# Altium schematic sheet 03 BGT24LTR11.SchDoc: <Project Name>
size A3; ApprovedBy: <Appr.>; Author: <Author>; CompanyName: Infineon Technologies AG; Engineer: <Rel.>; Organization: Infineon Technologies AG; Address1: IFAG DES S PS; Address2: Am Campeon 1-12  -  85579 Neubiberg  -  Germany; Address3: 85579 Neubiberg; Address4: Germany; Revision: <Rev.>; SheetNumber: 3; Release: RC00; PageSetup: Record=PageOptions|CenterHorizontal=True|CenterVertical=True|PrintScale=1.01|XCorrection=1.00|YCorrection=1.00|PrintKind=0|BorderSize=5000000|LeftOffset=0|BottomOffset=0|Orientation=2|PaperLength=1000|PaperWidth=1000|Scale=100|PaperSource=7|PrintQuality=-4|MediaType=1|DitherType=10|PaperKind=A3|PrintScaleMode=1; Doc_ConfidentialStatus: <Doc_ConfidentialStatus>; Doc_Preliminary: <Doc_Preliminary>
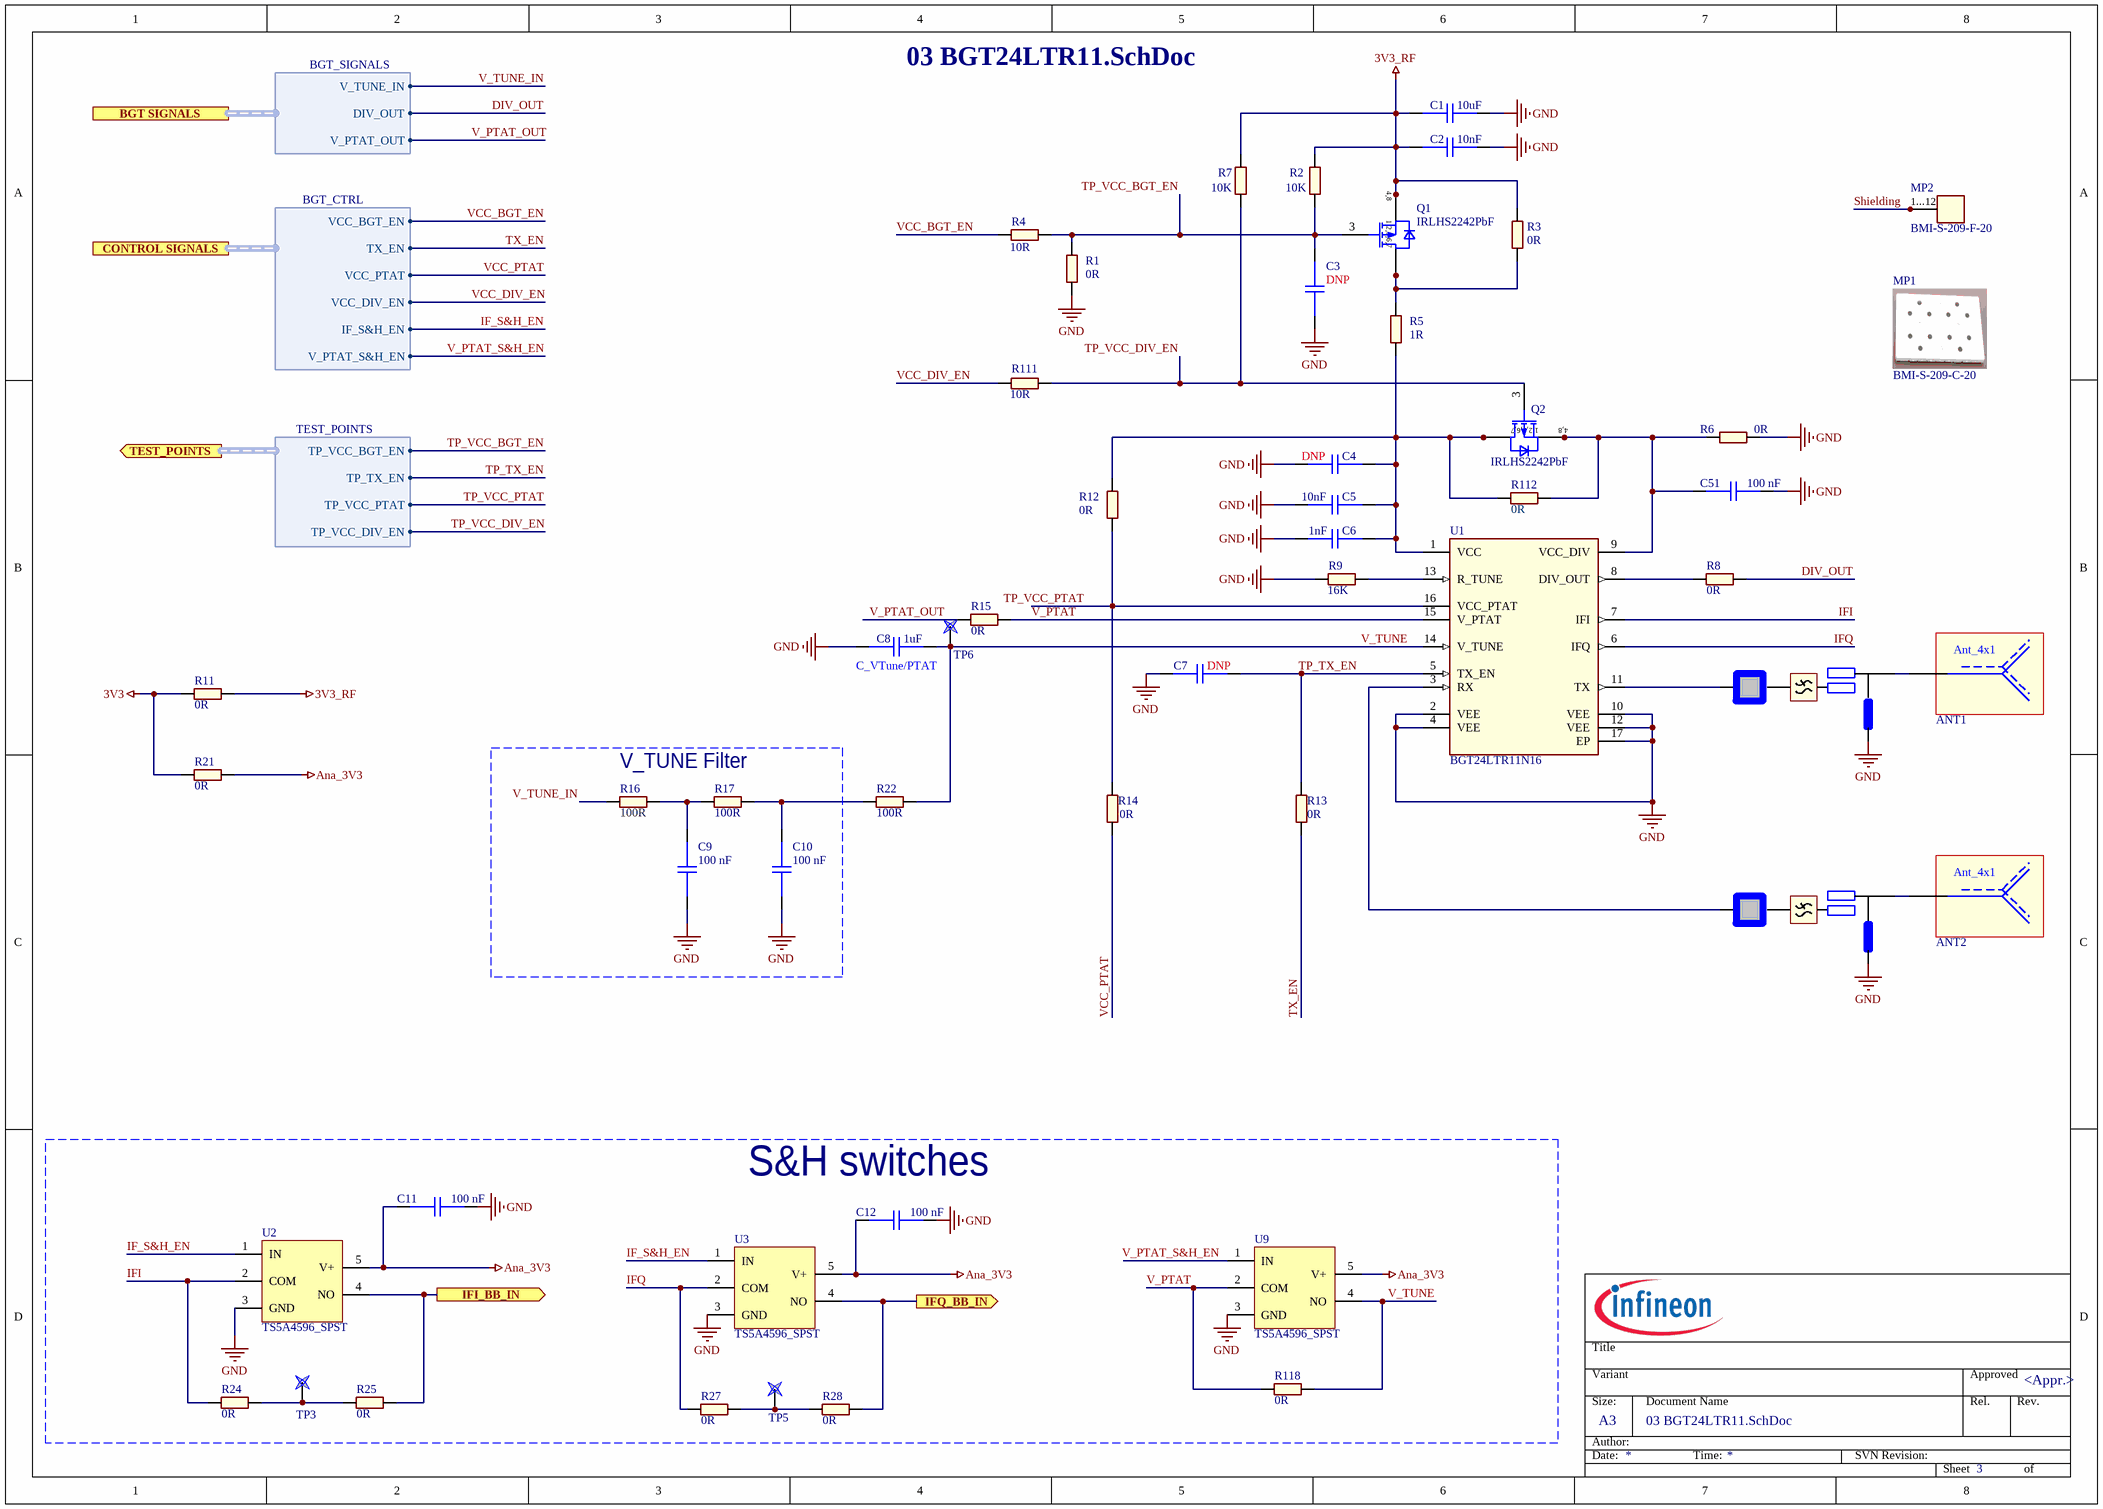
[diagram p0: 03 BGT24LTR11.SchDoc]

## Parts
ANT1  24GHZ S2G Antenna 4X1 Patch Array  [S2G_ANT]  (value not drawn)
ANT2  24GHZ S2G Antenna 4X1 Patch Array  [S2G_ANT]  (value not drawn)
C1  10uF  [CAPC1005X55N-0_2]
C2  10nF  [CAPC1005X55N-0_2]
C3  DNP  [CAPC1005X55N-0_2]
C4  DNP  [CAPC1005X55N-0_2]
C5  10nF  [CAPC1005X55N-0_2]
C6  1nF  [CAPC1005X55N-0_2]
C7  DNP  [CAPC1005X55N-0_2]
C8  1uF  [CAPC1005X55N-0_2]
C9  100 nF  [CAPC1005X55N-0_2]
C10  100 nF  [CAPC1005X55N-0_2]
C11  100 nF  [CAPC1005X55N-0_2]
C12  100 nF  [CAPC1005X55N-0_2]
C51  100 nF  [CAPC1005X55N-0_2]
M1  Maching 2nd Filter DCBlock  [MACHINING_LTR11]  (value not drawn)
M2  Maching 2nd Filter DCBlock  [OLD_MATCHING]  (value not drawn)
MP1  BMI-S-209-C-20  [SHIELD-BMI-S-209-C]
MP2  BMI-S-209-F-20  [SHIELD-SMD-BMI-S-209-F]
Q1  IRLHS2242PbF  [IRLHS2242-V]
Q2  IRLHS2242PbF  [IRLHS2242-V]
R1  0R  [RESC1005X40N_2]
R2  10K  [RESC1005X40N_2]
R3  0R  [RESC1005X40N_2]
R4  10R  [RESC1005X40N_2]
R5  1R  [RESC1005X40N_2]
R6  0R  [RESC1005X40N_2]
R7  10K  [RESC1005X40N_2]
R8  0R  [RESC1005X40N_2]
R9  16K  [RESC1005X40N_2]
R11  0R  [RESC1005X40N_2]
R12  0R  [RESC1005X40N_2]
R13  0R  [RESC1005X40N_2]
R14  0R  [RESC1005X40N_2]
R15  0R  [RESC1005X40N_2]
R16  100R  [RESC1005X40N_2]
R17  100R  [RESC1005X40N_2]
R21  0R  [RESC1005X40N_2]
R22  100R  [RESC1005X40N_2]
R24  0R  [RESC1005X40N_2]
R25  0R  [RESC1005X40N_2]
R27  0R  [RESC1005X40N_2]
R28  0R  [RESC1005X40N_2]
R111  10R  [RESC1005X40N_2]
R112  0R  [RESC1005X40N_2]
R118  0R  [RESC1005X40N_2]
TP3  Testpoint  [TP1.5MM]  (value not drawn)  (no BOM)
TP5  Testpoint  [TP1.5MM]  (value not drawn)  (no BOM)
TP6  Testpoint  [TP1.5MM]  (value not drawn)  (no BOM)
U1  BGT24LTR11N16  [PQFN50P240X240X77-17N-V]
U2  TS5A4596_SPST  [TS5A4597]
U3  TS5A4596_SPST  [TS5A4597]
U9  TS5A4596_SPST  [TS5A4597]

## Ports
BGT SIGNALS (harness BGT_SIGNALS), CONTROL SIGNALS (harness BGT_CTRL), IFI_BB_IN (out), IFQ_BB_IN (out), TEST_POINTS (out, harness TEST_POINTS)

## Harnesses
BGT_CTRL: VCC_BGT_EN, TX_EN, VCC_PTAT, VCC_DIV_EN, IF_S&H_EN, V_PTAT_S&H_EN
BGT_SIGNALS: V_TUNE_IN, DIV_OUT, V_PTAT_OUT
TEST_POINTS: TP_VCC_BGT_EN, TP_TX_EN, TP_VCC_PTAT, TP_VCC_DIV_EN

## Nets
3V3: R11.1 R21.2
3V3_RF: C1.1 C2.1 Q1.4(SOURCE1) Q1.8(SOURCE2) R2.2 R3.2 R7.2 R11.2
Ana_3V3: C11.2 C12.2 R21.1 U2.5(V+) U3.5(V+) U9.5(V+)
GND: C1.2 C2.2 C3.1 C4.1 C5.1 C6.1 C7.2 C8.2 C9.1 C10.1 C11.1 C12.1 C51.1 M1.3(GND) M2.3(GND) R1.1 R6.1 R9.1 U1.2(VEE) U1.4(VEE) U1.10(VEE) U1.12(VEE) U1.17(EP) U2.3(GND) U3.3(GND) U9.3(GND)
DIV_OUT: R8.1 ; port BGT SIGNALS.DIV_OUT
IF_S&H_EN: U2.1(IN) U3.1(IN) ; port CONTROL SIGNALS.IF_S&H_EN
IFI: R24.2 U1.7(IFI) U2.2(COM)
IFI_BB_IN: R25.1 U2.4(NO) ; port IFI_BB_IN
IFQ: R27.2 U1.6(IFQ) U3.2(COM)
IFQ_BB_IN: R28.1 U3.4(NO) ; port IFQ_BB_IN
Shielding: MP2.1 MP2.2 MP2.3 MP2.4
TP_TX_EN: C7.1 R13.2 U1.5(TX_EN) ; port TEST_POINTS.TP_TX_EN
TP_VCC_BGT_EN: C3.2 Q1.3(GATE) R1.2 R2.1 R4.2 ; port TEST_POINTS.TP_VCC_BGT_EN
TP_VCC_DIV_EN: Q2.3(GATE) R7.1 R111.2 ; port TEST_POINTS.TP_VCC_DIV_EN
TP_VCC_PTAT: R12.2 R14.1 U1.16(VCC_PTAT) ; port TEST_POINTS.TP_VCC_PTAT
TX_EN: R13.1 ; port CONTROL SIGNALS.TX_EN
V_PTAT: R15.2 R118.2 U1.15(V_PTAT) U9.2(COM)
V_PTAT_OUT: R15.1 ; port BGT SIGNALS.V_PTAT_OUT
V_PTAT_S&H_EN: U9.1(IN) ; port CONTROL SIGNALS.V_PTAT_S&H_EN
V_TUNE: C8.1 R22.1 R118.1 TP6.1 U1.14(V_TUNE) U9.4(NO)
V_TUNE_IN: R16.2 ; port BGT SIGNALS.V_TUNE_IN
VCC_BGT_EN: R4.1 ; port CONTROL SIGNALS.VCC_BGT_EN
VCC_DIV_EN: R111.1 ; port CONTROL SIGNALS.VCC_DIV_EN
VCC_PTAT: R14.2 ; port CONTROL SIGNALS.VCC_PTAT
NetANT1_1: ANT1.1 M1.2(ANT)
NetANT2_1: ANT2.1 M2.2(ANT)
NetC4_2: C4.2 C5.2 C6.2 Q2.1(DRAIN1) Q2.2(DRAIN2) Q2.5(DRAIN3) Q2.6(DRAIN4) Q2.7(DRAIN5) R5.1 R12.1 R112.2 U1.1(VCC)
NetC9_2: C9.2 R16.1 R17.2
NetC10_2: C10.2 R17.1 R22.2
NetC51_2: C51.2 Q2.4(SOURCE1) Q2.8(SOURCE2) R6.2 R112.1 U1.9(VCC_DIV)
NetM1_1: M1.1(IC_IN) U1.11(TX)
NetM2_1: M2.1(IC_IN) U1.3(RX)
NetQ1_1: Q1.1(DRAIN1) Q1.2(DRAIN2) Q1.5(DRAIN3) Q1.6(DRAIN4) Q1.7(DRAIN5) R3.1 R5.2
NetR8_2: R8.2 U1.8(DIV_OUT)
NetR9_2: R9.2 U1.13(R_TUNE)
NetR24_1: R24.1 R25.2 TP3.1
NetR27_1: R27.1 R28.2 TP5.1

## Notes on the sheet
- (near C8) C_VTune/PTAT
- V_TUNE Filter
- (near C12) S&H switches
- Title
- Variant
- Approved
- Date:
- Author:
- Size:
- A3
- Document Name
- Time:
- SVN Revision:
- Rel.
- Rev.
- Sheet
- of
- (in symbol 24GHz_S2G_ANT) Ant_4x1
- (in symbol 614556) 1...12
- (in symbol IFX01401479) 4,8; 1,2,5,6,7

## Library data of the parts
ANT1 ANT2 = 24GHz_S2G_ANT
C1 = CAP01010597: General Purpose Surface Mount Ceramic Capacitor; Manufacturer: muRata; PartRelease: new; Manufacturer Component Status: Active; ComponentStatus: Released; Voltage: 10Vdc; Tolerance: 2%; TemperaturCharacteristic: C0G; AutomotiveQualified: no; ColibryArticleNumber: 308039; PartNumber: CAP01010597; Value: 10uF; PackageReference: 0402; PackageDescription: Capacitor,non-polarized,Chip;1.00mm L X 0.50mm W X 0.55mm H; ComponentHeight: 0.55mm; PartType: General Purpose Surface Mount Ceramic Capacitor; ComponentLink1Description: Vendor WebSite; ComponentLink1URL: http://www.murata.com; ComponentLink2Description: Datasheet; ComponentLink2URL: \\MUCSDN31.eu.infineon.com\PCB_Library_Datasheets\GRM1555C1H101GA01.pdf; FixedSupplier: Yes; PartProvision: No; Supplier 1: Farnell; Supplier 2: Digi-Key; Supplier 3: Mouser
C2-C8 = CAP01010597: General Purpose Surface Mount Ceramic Capacitor; Manufacturer: muRata; PartRelease: new; Manufacturer Component Status: Active; ComponentStatus: Released; Voltage: 50Vdc; Tolerance: 2%; TemperaturCharacteristic: C0G; AutomotiveQualified: no; ColibryArticleNumber: 308039; PartNumber: CAP01010597; PackageReference: 0402; PackageDescription: Capacitor,non-polarized,Chip;1.00mm L X 0.50mm W X 0.55mm H; ComponentHeight: 0.55mm; PartType: General Purpose Surface Mount Ceramic Capacitor; ComponentLink1Description: Vendor WebSite; ComponentLink1URL: http://www.murata.com; ComponentLink2Description: Datasheet; ComponentLink2URL: \\MUCSDN31.eu.infineon.com\PCB_Library_Datasheets\GRM1555C1H101GA01.pdf; FixedSupplier: Yes; PartProvision: No; Supplier 1: Farnell; Supplier 2: Digi-Key; Supplier 3: Mouser
  C2 C5: Value: 10nF
  C3 C4 C7: Value: DNP
  C6: Value: 1nF
  C8: Value: 1uF
C9-C11 C51 = CAP01010597: General Purpose Surface Mount Ceramic Capacitor; Manufacturer: muRata; PartRelease: new; Manufacturer Component Status: Active; ComponentStatus: Released; Voltage: 16Vdc; Tolerance: 2%; TemperaturCharacteristic: C0G; AutomotiveQualified: no; ColibryArticleNumber: 308039; PartNumber: CAP01010597; Value: 100 nF; Type: 100 nF; PackageReference: 0402; PackageDescription: Capacitor,non-polarized,Chip;1.00mm L X 0.50mm W X 0.55mm H; ComponentHeight: 0.55mm; PartType: General Purpose Surface Mount Ceramic Capacitor; ComponentLink1Description: Vendor WebSite; ComponentLink1URL: http://www.murata.com; ComponentLink2Description: Datasheet; ComponentLink2URL: \\MUCSDN31.eu.infineon.com\PCB_Library_Datasheets\GRM1555C1H101GA01.pdf; FixedSupplier: Yes; PartProvision: No; Supplier 1: Farnell; Supplier 2: Digi-Key; Supplier 3: Mouser
C12 = CAP01010597: General Purpose Surface Mount Ceramic Capacitor; Manufacturer: muRata; ManufacturerPartNumber: GRM1555C1H101GA01D; PartRelease: new; Manufacturer Component Status: Active; ComponentStatus: Released; Voltage: 16Vdc; Tolerance: 2%; TemperaturCharacteristic: C0G; AutomotiveQualified: no; ColibryArticleNumber: 308039; PartNumber: CAP01010597; Value: 100 nF; Type: 100 nF; PackageReference: 0402; PackageDescription: Capacitor,non-polarized,Chip;1.00mm L X 0.50mm W X 0.55mm H; ComponentHeight: 0.55mm; PartType: General Purpose Surface Mount Ceramic Capacitor; ComponentLink1Description: Vendor WebSite; ComponentLink1URL: http://www.murata.com; ComponentLink2Description: Datasheet; ComponentLink2URL: \\MUCSDN31.eu.infineon.com\PCB_Library_Datasheets\GRM1555C1H101GA01.pdf; FixedSupplier: Yes; PartProvision: No; Supplier 1: Farnell; Supplier 2: Digi-Key; Supplier Part Number 2: 490-6188-2-ND; Supplier 3: Mouser; Supplier Part Number 3: 81-GRM1555C1H101GA1D
M1 M2 = Matching_24_Duty
MP1 = 614567: Standard Board Level Shield Frame Cover 1008/1010 PRE-PLATED COLD ROLLED STEEL; Manufacturer: Laird; Alternate View: No; Symbol Type: Standard Surface Mount Shield Cover; Article Number: 614567; Version Number: V01; Legacy DeviceID: LAIRD_BMI-S-209-C-20; Combined Parameters: Steel Rectangular 29.86x- -; Style: Rectangular; PLMStatus: Active; Second Source allowed: Yes; Voltage DC (max): na; Multiple Parts: No; Part Type: Mechanical; Manufacturer Order Number: BMI-S-209-C-20; Value: BMI-S-209-C-20; Temperature Range: Military; ROHS Compliant: N; Automotive Qualified: No; ComponentLink1Description: Vendor WebSite; ComponentLink1URL: https://www.lairdtech.com; ComponentLink2Description: Datasheet; ComponentLink2URL: http://webnetprod.muc.infineon.com/PCBPortal_Prod/WorkFlows/AltiumComponent/StandardDocumentation?Versionid=614568; Supplier 1: Farnell; Supplier 2: DigiKey; Supplier Part Number 2: 903-1185-ND; Supplier 3: Mouser; Supplier Part Number 3: 739-BMIS-209-C; Package Description: Shield, 29.86 mm L X 19.00 mm W X 1.85 mm H body
MP2 = 614556: Standard Board Level Shield Frame 1008/1010 PRE-PLATED COLD ROLLED STEEL; Manufacturer: Laird; Alternate View: No; Symbol Type: Standard Surface Mount Shield Frame; Article Number: 614556; Version Number: V01; Legacy DeviceID: LAIRD_BMI-S-209-F-20; Combined Parameters: Steel Rectangular 29.36x- -; Style: Rectangular; PLMStatus: Active; Second Source allowed: Yes; Voltage DC (max): na; Multiple Parts: No; Part Type: Mechanical; Manufacturer Order Number: BMI-S-209-F-20; Value: BMI-S-209-F-20; Temperature Range: Military; ROHS Compliant: N; Automotive Qualified: No; PackageReference: SMD; ComponentLink1Description: Vendor WebSite; ComponentLink1URL: https://www.lairdtech.com; ComponentLink2Description: Datasheet; ComponentLink2URL: http://webnetprod.muc.infineon.com/PCBPortal_Prod/WorkFlows/AltiumComponent/StandardDocumentation?Versionid=614557; Supplier 1: Farnell; Supplier 2: DigiKey; Supplier Part Number 2: 903-1212-1-ND; Supplier 3: Mouser; Supplier Part Number 3: 739-BMIS-209-F; Package Description: Shield, SMD, 12 pin, 29.36 mm L X 18.50 mm W X 2.10 mm H body
Q1 Q2 = IFX01401479: HEXFET Power Mosfet, VDS -20V; Manufacturer: Infineon Technologies; PartProvision: yes; PartRelease: new; Manufacturer Component Status: Active; Alternate View: No; Symbol Type: Insulated-Gate Field-Effect Transistor (IGFET), P-Channel, Enhancement, Body Diode, Pin 1 Drain, 2 Drain, 3 Gate, 4 Source, 5 Drain, 6 Drain, 7 Drain, 8 Source, 8 Pins; ComponentName: IFX_IRLHS2242PbF; ComponentStatus: Released; ColibryArticleNumber: 431870; Multiple Parts: No; Value: IRLHS2242PbF; Supplier 1: Farnell; Supplier Part Number 1: 2114663; Supplier 2: Digi-Key; Supplier Part Number 2: IRLHS2242TRPBFTR-ND; Supplier 3: Mouser; Supplier Part Number 3: 942-IRLHS2242TRPBF; PartNumber: IFX01401479; ComponentHeight: 1mm; ManufacturerPartNumber: IRLHS2242PbF; PackageDescription: PQFN, 0.65mm Pitch, 8 Pin, 2mm L X 2mm W X 1mm H body; PackageReference: PQFN 2X2; AutomotiveQualified: no; ComponentLink1Description: Vendor WebSite; ComponentLink1URL: http://www.infineon.com; ComponentLink2Description: Datasheet; ComponentLink2URL: \\MUCSDN31.eu.infineon.com\PCB_Library_Datasheets\IRLHS2242PbF.pdf; FixedSupplier: yes
R1 R13 = RES01800000: 0R/50V/20mOhm; Manufacturer: Vishay; PartProvision: no; PartRelease: new; Manufacturer Component Status: Active; Symbol Type: Standard Resistor Symbol; Alternate View: yes; ComponentStatus: Released; Power: 1.5A; Voltage: 50V; Tolerance: 20mOhm; AutomotiveQualified: AEC-Q200; ColibryArticleNumber: 339877; PartNumber: RES01800000; PackageReference: 0402; Value: 0R; Type: 0R/50V/20mOhm; PartType: Thick Film Chip Resistor; ComponentHeight: 0.4mm; TK: -; ComponentLink1Description: Vendor WebSite; ComponentLink1URL: http://www.vishay.com/; ComponentLink2Description: Datasheet; ComponentLink2URL: \\MUCSDN31.eu.infineon.com\PCB_Library_Datasheets\dcrcwe3.pdf; FixedSupplier: no
R2 R7 = RES01800000: 10K/50V/20mOhm; Manufacturer: Vishay; PartProvision: no; PartRelease: new; Manufacturer Component Status: Active; Symbol Type: Standard Resistor Symbol; Alternate View: yes; ComponentStatus: Released; Power: 1.5A; Voltage: 50V; Tolerance: 20mOhm; AutomotiveQualified: AEC-Q200; ColibryArticleNumber: 339877; PartNumber: RES01800000; PackageReference: 0402; Value: 10K; Type: 10K/50V/20mOhm; PartType: Thick Film Chip Resistor; ComponentHeight: 0.4mm; TK: -; ComponentLink1Description: Vendor WebSite; ComponentLink1URL: http://www.vishay.com/; ComponentLink2Description: Datasheet; ComponentLink2URL: \\MUCSDN31.eu.infineon.com\PCB_Library_Datasheets\dcrcwe3.pdf; FixedSupplier: no
R3 R6 R8 R11 R12 R14 R15 R21 R24 R25 R27 R28 R112 R118 = RES01800000: 0R/50V/20mOhm; Manufacturer: Vishay; ManufacturerPartNumber: CRCW04020000Z0ED; PartProvision: no; PartRelease: new; Manufacturer Component Status: Active; Symbol Type: Standard Resistor Symbol; Alternate View: yes; ComponentStatus: Released; Power: 1.5A; Voltage: 50V; Tolerance: 20mOhm; AutomotiveQualified: AEC-Q200; ColibryArticleNumber: 339877; PartNumber: RES01800000; PackageReference: 0402; Value: 0R; Type: 0R/50V/20mOhm; PartType: Thick Film Chip Resistor; ComponentHeight: 0.4mm; TK: -; ComponentLink1Description: Vendor WebSite; ComponentLink1URL: http://www.vishay.com/; ComponentLink2Description: Datasheet; ComponentLink2URL: \\MUCSDN31.eu.infineon.com\PCB_Library_Datasheets\dcrcwe3.pdf; FixedSupplier: no
R4 R111 = RES01800000: 10R/50V/20mOhm; Manufacturer: Vishay; PartProvision: no; PartRelease: new; Manufacturer Component Status: Active; Symbol Type: Standard Resistor Symbol; Alternate View: yes; ComponentStatus: Released; Power: 1.5A; Voltage: 50V; Tolerance: 20mOhm; AutomotiveQualified: AEC-Q200; ColibryArticleNumber: 339877; PartNumber: RES01800000; PackageReference: 0402; Value: 10R; PartType: Thick Film Chip Resistor; ComponentHeight: 0.4mm; TK: -; ComponentLink1Description: Vendor WebSite; ComponentLink1URL: http://www.vishay.com/; ComponentLink2Description: Datasheet; ComponentLink2URL: \\MUCSDN31.eu.infineon.com\PCB_Library_Datasheets\dcrcwe3.pdf; FixedSupplier: no
R5 = RES01800000: 1R/50V/20mOhm; Manufacturer: Vishay; PartProvision: no; PartRelease: new; Manufacturer Component Status: Active; Symbol Type: Standard Resistor Symbol; Alternate View: yes; ComponentStatus: Released; Power: 1.5A; Voltage: 50V; Tolerance: 20mOhm; AutomotiveQualified: AEC-Q200; ColibryArticleNumber: 339877; PartNumber: RES01800000; PackageReference: 0402; Value: 1R; PartType: Thick Film Chip Resistor; ComponentHeight: 0.4mm; TK: -; ComponentLink1Description: Vendor WebSite; ComponentLink1URL: http://www.vishay.com/; ComponentLink2Description: Datasheet; ComponentLink2URL: \\MUCSDN31.eu.infineon.com\PCB_Library_Datasheets\dcrcwe3.pdf; FixedSupplier: no
R9 = RES01800000: 16K/50V/20mOhm; Manufacturer: Vishay; PartProvision: no; PartRelease: new; Manufacturer Component Status: Active; Symbol Type: Standard Resistor Symbol; Alternate View: yes; ComponentStatus: Released; Power: 1.5A; Voltage: 50V; Tolerance: 20mOhm; AutomotiveQualified: AEC-Q200; ColibryArticleNumber: 339877; PartNumber: RES01800000; PackageReference: 0402; Value: 16K; Type: 16K/50V/20mOhm; PartType: Thick Film Chip Resistor; ComponentHeight: 0.4mm; TK: -; ComponentLink1Description: Vendor WebSite; ComponentLink1URL: http://www.vishay.com/; ComponentLink2Description: Datasheet; ComponentLink2URL: \\MUCSDN31.eu.infineon.com\PCB_Library_Datasheets\dcrcwe3.pdf; FixedSupplier: no
R16 R17 R22 = RES01800000: 100R/50V/0402; Manufacturer: Vishay; PartProvision: no; PartRelease: new; Manufacturer Component Status: Active; Symbol Type: Standard Resistor Symbol; Alternate View: yes; ComponentStatus: Released; Power: 1.5A; Voltage: 50V; Tolerance: 20mOhm; AutomotiveQualified: AEC-Q200; ColibryArticleNumber: 339877; PartNumber: RES01800000; PackageReference: 0402; Value: 100R; Type: 100R/50V/0402; PartType: Thick Film Chip Resistor; ComponentHeight: 0.4mm; TK: -; ComponentLink1Description: Vendor WebSite; ComponentLink1URL: http://www.vishay.com/; ComponentLink2Description: Datasheet; ComponentLink2URL: \\MUCSDN31.eu.infineon.com\PCB_Library_Datasheets\dcrcwe3.pdf; FixedSupplier: no
TP3 TP5 TP6 = P_PRUEFPAD: FootprintBOM: Testpoint; Preis: -
U1 = IFX01401046: Silicon Germanium 24GHz Radar Transceiver MMIC; Multiple Parts: No; Manufacturer: Infineon Technologies; PartProvision: yes; PartRelease: new; Manufacturer Component Status: Active; ComponentName: IFX_BGT24LTR11N16; ComponentStatus: Released; ColibryArticleNumber: 428002; Symbol Type: Silicon Germanium 24GHz Radar Transceiver MMIC; Alternate View: No; Value: BGT24LTR11N16; Supplier 1: Farnell; Supplier 2: Digi-Key; Supplier 3: Mouser; PartNumber: IFX01401046; ComponentHeight: 0.77mm; ManufacturerPartNumber: BGT24LTR11N16; PackageDescription: PQFN,0.50mm pitch,square;16 pin,2.40mm L X 2.40mm W X 0.77mm H body (w/pullback leads,thermal tab); PackageReference: TSNP-16-9; AutomotiveQualified: no; ComponentLink1Description: Vendor WebSite; ComponentLink1URL: http://www.infineon.com; ComponentLink2Description: Datasheet; ComponentLink2URL: \\MUCSDN31.eu.infineon.com\PCB_Library_Datasheets\BGT 24LTR11N16 E6327.pdf; FixedSupplier: yes
U2 = TS5A4596DCKRSC70: Single-Channel 8ohm SPST Analog Switch TS5A4596_SPST; ComponentLink1Description: Manufacturer Link; ComponentLink1URL: http://www.ti.com/lit/ds/symlink/ts5a4597.pdf
U3 U9 = TS5A4596DCKRSC70: ComponentLink1Description: Manufacturer Link; ComponentLink1URL: http://www.ti.com/lit/ds/symlink/ts5a4597.pdf